# EAGLE design Arduino_V13_5x5 (EAGLE 7.1.0)
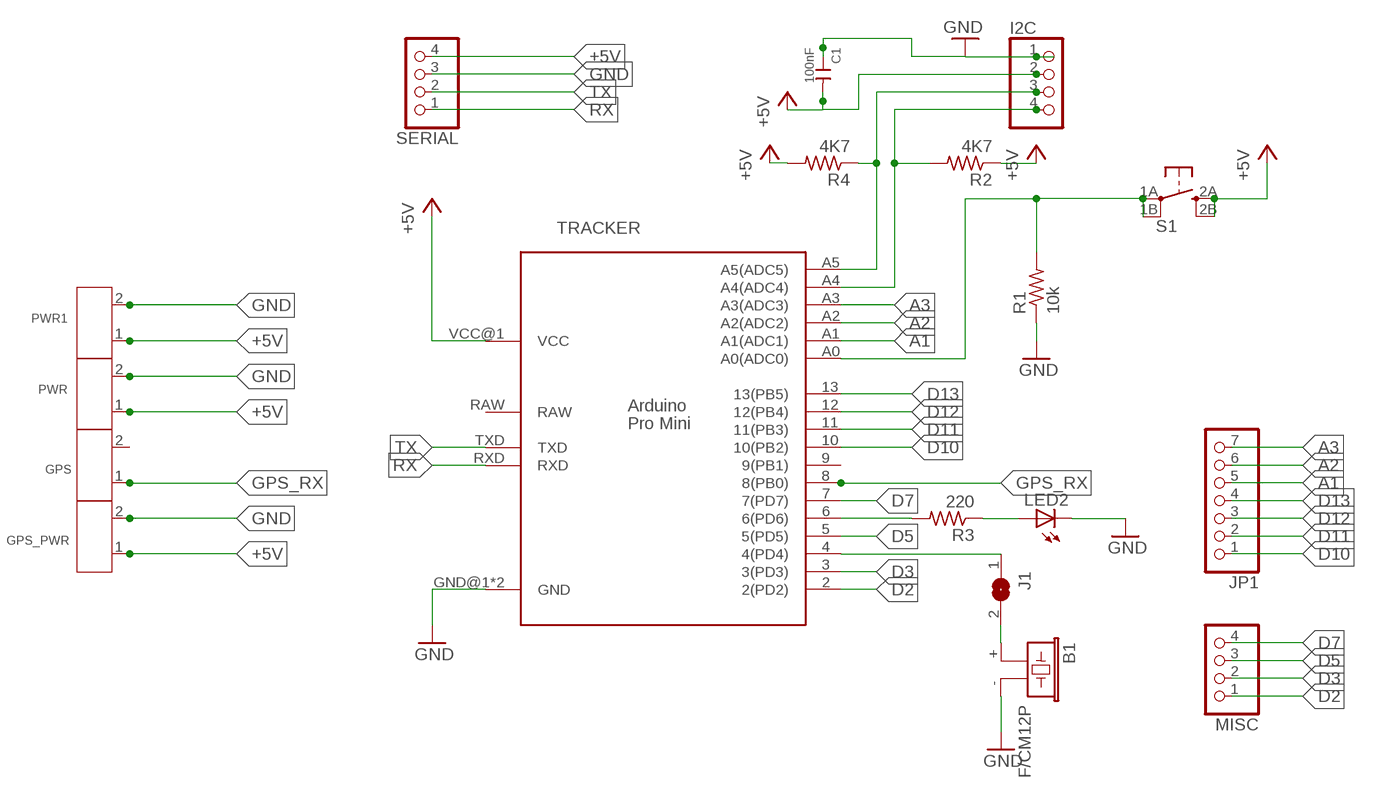
[diagram p0: schematic, sheet 1]

## Parts
B1  F/CM12P  [F/CM12P]
C1  100nF  CERAMIC-10UF-25V-10%-X5R(1206)  [C1206]
GPS  SCREW-TERMINAL-GREEN(2P-3.5)  [H2-3.5-7.0X7.0MM]
GPS_PWR  SCREW-TERMINAL-GREEN(2P-3.5)  [H2-3.5-7.0X7.0MM]
I2C  PINHD-1X4  [1X04]
J1  SJ  [SJ]
JP1  PINHD-1X7  [1X07]
LED2  LED5MM  [LED5MM]
MISC  PINHD-1X4  [1X04]
PWR  SCREW-TERMINAL-GREEN(2P-3.5)  [H2-3.5-7.0X7.0MM]
PWR1  SCREW-TERMINAL-GREEN(2P-3.5)  [H2-3.5-7.0X7.0MM]
R1  10k  R-US_M1206  [M1206]
R2  4K7  R-US_M1206  [M1206]
R3  220  R-US_M1206  [M1206]
R4  4K7  R-US_M1206  [M1206]
S1  TACTILETACT-6X6-PTH  [TACTILE-PTH]
SERIAL  PINHD-1X4  [1X04]
TRACKER  PRO-MINI  [PRO-MINI]

## Nets
+5V: C1.2 GPS_PWR.1 I2C.2 PWR1.1 PWR.1 R2.1 R4.2 S1.2A S1.2B SERIAL.4 TRACKER.VCC@1(VCC)
A1: JP1.5 TRACKER.A1(A1(ADC1))
A2: JP1.6 TRACKER.A2(A2(ADC2))
A3: JP1.7 TRACKER.A3(A3(ADC3))
A4: I2C.4 R2.2 TRACKER.A4(A4(ADC4))
BUTTON: R1.2 S1.1A S1.1B TRACKER.A0(A0(ADC0))
BUZZER: J1.1 TRACKER.4(4(PD4))
D2: MISC.1 TRACKER.2(2(PD2))
D3: MISC.2 TRACKER.3(3(PD3))
D5: MISC.3 TRACKER.5(5(PD5))
D7: MISC.4 TRACKER.7(7(PD7))
D10: JP1.1 TRACKER.10(10(PB2))
D11: JP1.2 TRACKER.11(11(PB3))
D12: JP1.3 TRACKER.12(12(PB4))
D13: JP1.4 TRACKER.13(13(PB5))
GND: B1.- C1.1 GPS_PWR.2 I2C.1 LED2.K(C) PWR1.2 PWR.2 R1.1 SERIAL.3 TRACKER.GND@1(GND) TRACKER.GND@2(GND)
GPS_RX: GPS.1 TRACKER.8(8(PB0))
N$1: I2C.3 R4.1 TRACKER.A5(A5(ADC5))
N$4: LED2.A R3.1
N$5: R3.2 TRACKER.6(6(PD6))
N$10: B1.+ J1.2
RX: SERIAL.1 TRACKER.RXD
TX: SERIAL.2 TRACKER.TXD
Unconnected: GPS.2 TRACKER.9(9(PB1)) TRACKER.RAW

## Library data of the parts
B1 = buzzer:F/CM12P: BUZZER Source: Buerklin; OC_FARNELL: unknown; OC_NEWARK: unknown
C1 = Seeed-Capacitor-2016:CERAMIC-10UF-25V-10%-X5R(1206): 302010181; MPN: CC1206KKX5R8BB106; VALUE: 10uf
GPS GPS_PWR PWR PWR1 = Seeed-Connector -2016:SCREW-TERMINAL-GREEN(2P-3.5): 320110028; VALUE: GREEN-2P-3.5
I2C MISC SERIAL = pinhead:PINHD-1X4: PIN HEADER
J1 = jumper:SJ: SMD solder JUMPER
JP1 = pinhead:PINHD-1X7: PIN HEADER
LED2 = SparkFun:LED: LEDs Standard schematic elements and footprints for 5mm, 3mm, 1206, and 0603 sized LEDs. 5mm - Spark Fun Electronics SKU : COM-00529 (and others)
R1-R4 = resistor:R-US_: RESISTOR, American symbol
S1 = SmallRoomLabs:TACTILE
TRACKER = Arduino:PRO-MINI

## Board
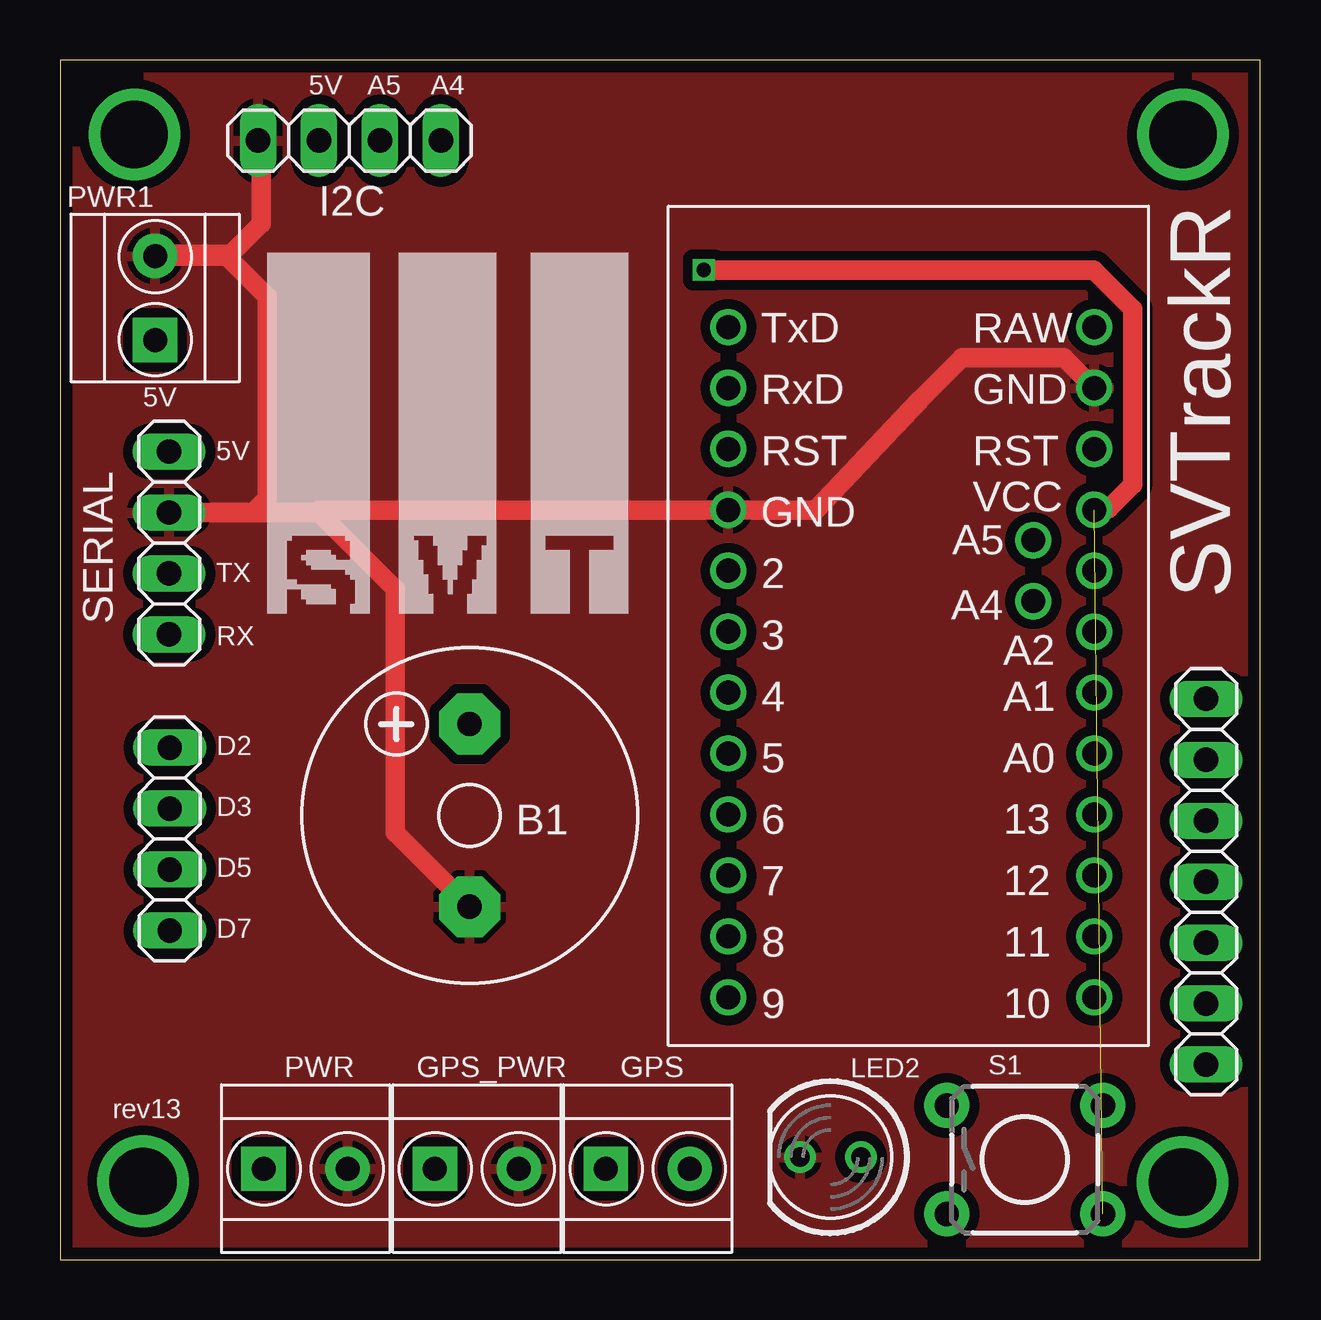
[diagram p1: board, top side]
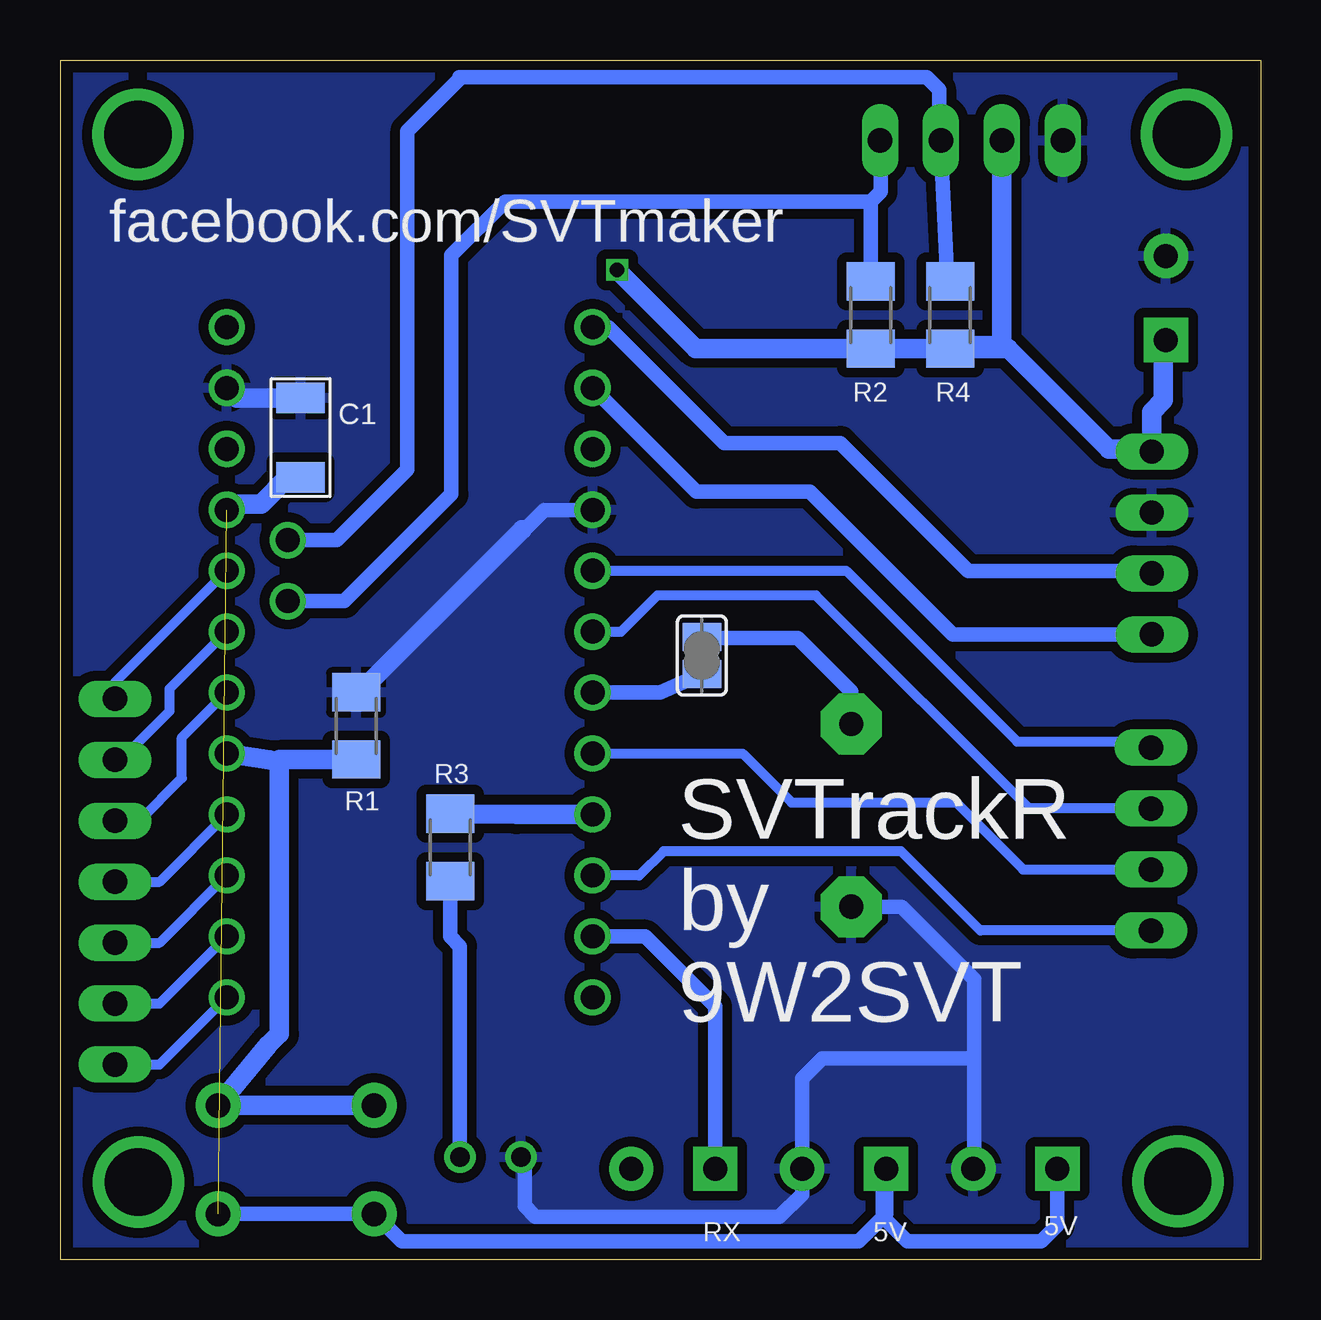
[diagram p2: board, bottom side, seen from below]

Size 50 x 50 mm. Coordinates in mm from the lower left corner, seen from the top.
Outline: 0,0 50,0 50,50 0,50 0,0
Copper layers (1*16): Top 0.035mm / dielectric 1.5mm / Bottom 0.035mm
Design rules "Smart-Prototyping": minimum track width 7mil, minimum drill 12mil, track to track 7mil, track to pad 7mil, pad to pad 7mil, via to via 7mil, smd to smd 0mil, copper to edge 20mil, drill to drill 10mil, minimum pad ring 10mil, minimum via ring 6mil, stop-mask expansion 2mil, vias tented up to drill 25mil, thermal gap 10mil

### Footprints (pad centres in the part's own frame; a part is rotated, then mirrored left to right if it is on the bottom)
F/CM12P = drill 1.016 pad 2.54 octagon: + 3.81,0; - -3.81,0
C1206 = smd 1.27 x 2.032: 1 -1.651,0; 2 1.651,0
H2-3.5-7.0X7.0MM = drill 1 pad 1.85 square: 1 -1.75,0 | drill 1 pad 1.85: 2 1.75,0
1X04 = drill 1.016 long: 1 -3.81,0; 2 -1.27,0; 3 1.27,0; 4 3.81,0
SJ = smd 1.168 x 1.6: 1 -0.762,0; 2 0.762,0
1X07 = drill 1.016 long: 1 -7.62,0; 2 -5.08,0; 3 -2.54,0; 4 0,0; 5 2.54,0; 6 5.08,0; 7 7.62,0
LED5MM = drill 0.813: A -1.27,0; K 1.27,0
M1206 = smd 1.6 x 2: 1 -1.4,0; 2 1.4,0
TACTILE-PTH = drill 1.016 pad 1.88: 1A -3.251,2.261; 1B 3.251,2.261; 2A -3.251,-2.261; 2B 3.251,-2.261
PRO-MINI = drill 1: 2 2.48,19.794; 3 2.48,17.254; 4 2.48,14.714; 5 2.48,12.174; 6 2.48,9.634; 7 2.48,7.094; 8 2.48,4.554; 9 2.48,2.014; 10 17.72,2.014; 11 17.72,4.554; 12 17.72,7.094; 13 17.72,9.634; A0 17.72,12.174; A1 17.72,14.714; A2 17.72,17.254; A3 17.72,19.794; A4 15.18,18.524; A5 15.18,21.064; GND@1 2.48,22.334; GND@2 17.72,27.414; RAW 17.72,29.954; RST@1 2.48,24.874; RST@2 17.72,24.874; RXD 2.48,27.414; TXD 2.48,29.954; VCC@1 17.72,22.334

### Placement (x,y rotation side)
B1  17.07,18.51 90 top
C1  40.02,34.26 270 bottom
GPS  24.49,3.78 0 top
GPS_PWR  17.37,3.78 0 top
I2C  12.06,46.64 0 top
J1  23.29,25.18 90 bottom
JP1  47.75,15.75 90 top
LED2  32.11,4.27 180 top
MISC  4.57,17.53 270 top
PWR  10.23,3.78 0 top
PWR1  3.96,40.08 90 top
R1  37.7,22.24 270 bottom
R2  16.26,39.37 90 bottom
R3  33.78,17.18 90 bottom
R4  12.95,39.37 270 bottom
S1  40.2,4.16 0 top
SERIAL  4.55,29.87 90 top
TRACKER  25.37,8.92 0 top

### Tracks (layer width: path | path; a pad name or v marks a point on that pad's centre or on a via)
+5V  (via drill 0.6)  (1 unrouted)
  Top 0.813: v26.82,41.25 43.08,41.25 44.7,39.62 44.7,32.31 43.69,31.29 43.13,31.29 TRACKER.VCC@1
  Bottom 0.61: S1.2B S1.2A 35.81,0.76 16.76,0.76 15.62,1.91 GPS_PWR.1 15.75,3.45 15.75,1.78 14.73,0.76 9.14,0.76 8.48,1.43 PWR.1
  Bottom 0.813: v26.82,41.25 23.54,37.97 R2.1 R4.2 | PWR1.1 4.06,38.23 4.06,35.81 4.55,35.33 SERIAL.4 4.65,33.78 6.35,33.78 10.54,37.97 R4.2 | C1.2 40.55,32.61 41.66,31.5 42.84,31.5 TRACKER.VCC@1 | I2C.2 10.79,38.23 10.92,38.1 12.82,38.1 R4.2
A1
  Bottom 0.406: JP1.5 46.74,18.29 44.96,20.07 44.96,21.76 TRACKER.A1
A2
  Bottom 0.406: JP1.6 47.5,20.83 45.47,22.86 45.47,23.79 TRACKER.A2
A3
  Bottom 0.406: JP1.7 47.75,24.05 TRACKER.A3
A4
  Bottom 0.61: TRACKER.A4 38.19,27.44 33.73,31.9 33.73,41.86 31.5,44.09 16.26,44.09 | 16.05,46.46 I2C.4 15.85,46.62 15.85,44.5 16.26,44.09 | 16.26,44.09 R2.2
BUTTON
  Bottom 0.406: 41.31,20.83 40.89,20.83
  Bottom 0.813: 41.31,20.83 TRACKER.A0 | S1.1A S1.1B 41.35,8.94 40.89,9.4 40.89,20.83 40.88,20.84 R1.2
BUZZER
  Bottom 0.61: TRACKER.4 25.03,23.63 J1.1
D2
  Bottom 0.406: TRACKER.2 17.28,28.71 10.16,21.59 4.83,21.59 MISC.1
D3
  Bottom 0.406: MISC.2 9.65,18.8 18.54,27.69 25.15,27.69 26.67,26.16 TRACKER.3
D5
  Bottom 0.406: TRACKER.5 21.6,21.09 19.56,19.05 12.7,19.05 9.91,16.26 MISC.3
D7
  Bottom 0.406: MISC.4 11.68,13.72 14.99,17.02 24.89,17.02 25.91,16 TRACKER.7
D10
  Bottom 0.406: TRACKER.10 45.89,8.13 JP1.1
D11
  Bottom 0.406: JP1.2 45.89,10.67 TRACKER.11
D12
  Bottom 0.406: JP1.3 45.89,13.21 TRACKER.12
D13
  Bottom 0.406: JP1.4 45.89,15.75 TRACKER.13
GND
  Top 0.61: TRACKER.GND@1
  Top 0.813: B1.- 13.97,17.8 13.97,27.94 10.77,31.14 10.67,31.14 | TRACKER.GND@2 41.83,37.59 37.59,37.59 35.82,35.82 31.5,31.24 TRACKER.GND@1 | 10.67,31.14 SERIAL.3 8.02,31.14 8.64,31.75 8.64,40.13 6.86,41.91 4.04,41.91 PWR1.2 7.03,41.83 8.38,43.18 8.38,46.51 I2C.1 | TRACKER.GND@1 | TRACKER.GND@1 10.77,31.24 10.67,31.14
  Bottom 0.406: 28.2,31.25 TRACKER.GND@1
  Bottom 0.61: B1.- 14.96,14.7 11.94,11.68 11.94,8.38 | 11.94,8.38 11.94,3.62 PWR.2 | 11.94,8.38 18.29,8.38 19.12,7.55 GPS_PWR.2 19.12,2.73 20.07,1.78 30.23,1.78 30.68,2.23 30.68,4.12 LED2.K | 30.79,30.43 30.68,30.43 29.87,31.24 TRACKER.GND@1
  Bottom 0.813: R1.1 37.57,23.64 30.79,30.43 | 43.34,36.58 TRACKER.GND@2 42.67,35.91 C1.1
  pour Bottom (isolate 0.406): 0.51,49.53 49.53,49.53 49.53,0.25 0.51,0.25
  pour Top (isolate 0.406): 49.78,49.53 49.78,0.25 0.25,0.25 0.51,49.28 0.51,49.53
GPS_RX
  Bottom 0.61: GPS.1 22.74,10.55 25.65,13.46 TRACKER.8
N$1
  Bottom 0.61: R4.1 13.08,40.89 13.33,46.48 I2C.3 13.41,46.72 13.41,48.77 13.92,49.28 33.33,49.28 | 33.4,49.28 33.33,49.28 | TRACKER.A5 38.5,29.98 35.56,32.92 35.56,47.04 33.33,49.28
N$4
  Bottom 0.61: R3.1 33.78,13.46 33.38,13.06 LED2.A
N$5
  Bottom 0.813: TRACKER.6 31.01,18.55 R3.2
N$6  (via drill 2.8)
  other vias: 3.46,3.26
N$7  (via drill 2.8)
  other vias: 3.1,46.89
N$8  (via drill 2.8)
  other vias: 46.79,46.89
N$9  (via drill 2.8)
  other vias: 46.77,3.23
N$10
  Bottom 0.61: B1.+ 17.07,23.67 19.3,25.91 23.26,25.91 J1.2
RX
  Bottom 0.61: SERIAL.1 12.85,26.06 18.8,32 23.52,32 TRACKER.RXD
TX
  Bottom 0.61: TRACKER.TXD 27.19,38.87 22.35,34.04 17.53,34.04 12.19,28.7 4.65,28.7 SERIAL.2

### Text on the board
tNames: 5V | A5 | A4 | SVTrackR | 5V | 5V | TX | RX | D2 | D3 | D5 | D7 | rev13
bNames: facebook.com/SVTmaker | SVTrackR / by / 9W2SVT | 5V | 5V | RX